# Altium schematic sheet Motor.SchDoc
size A4; SheetNumber: 5; SheetTotal: 5
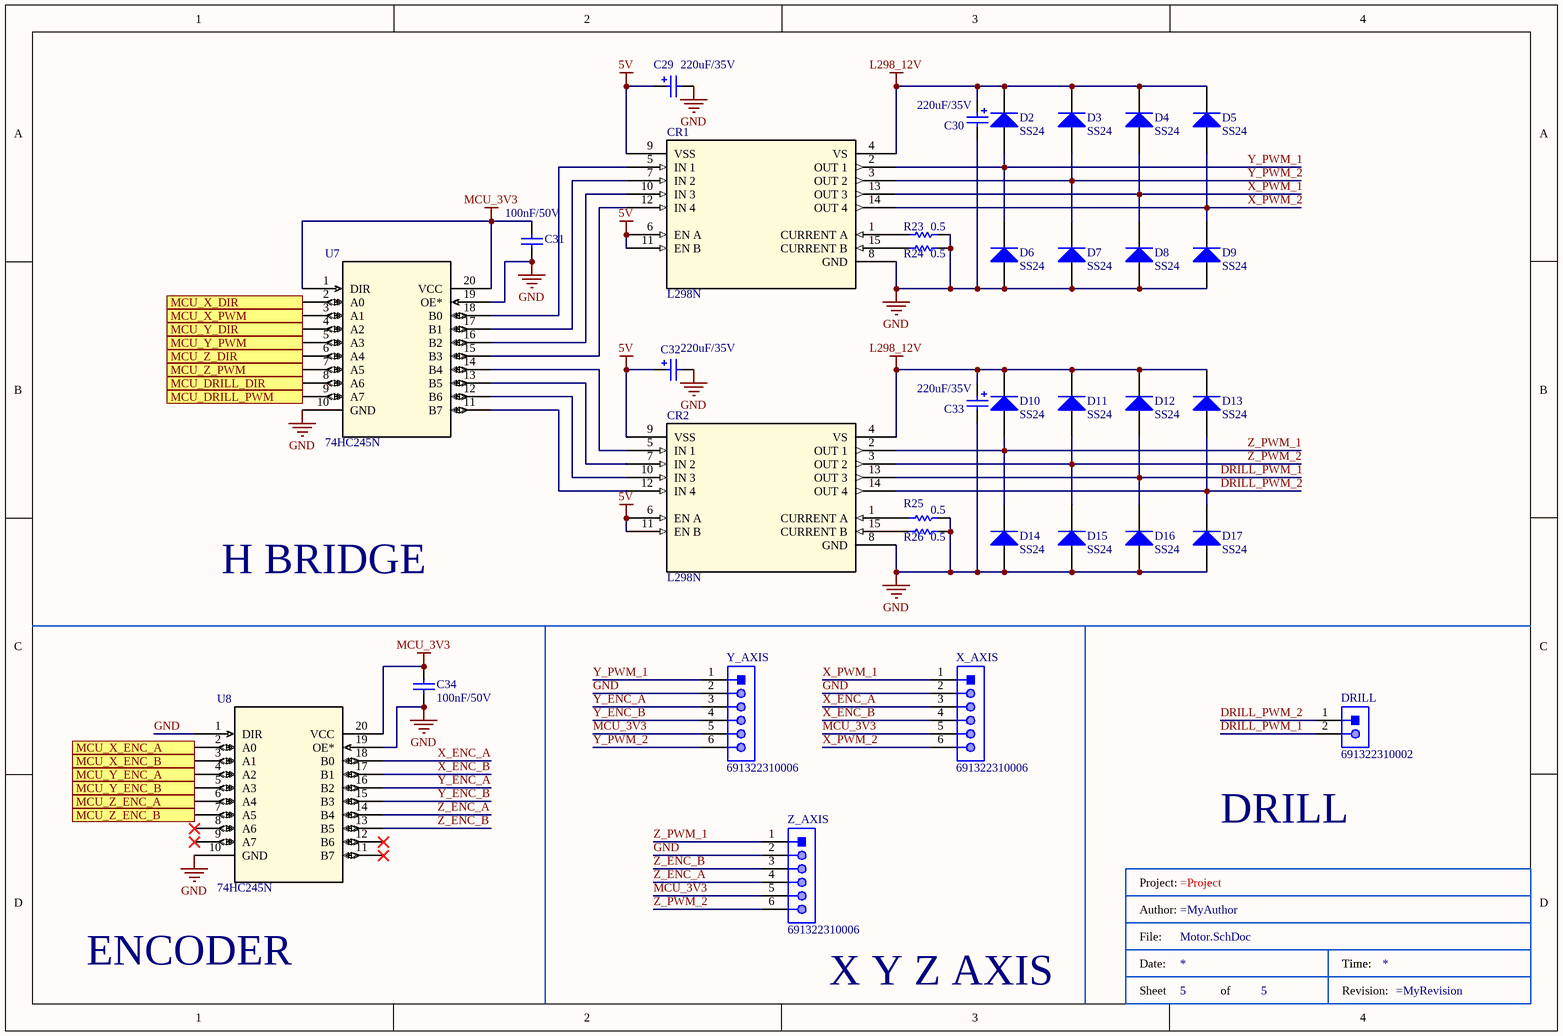
[diagram p0: Motor.SchDoc]

## Parts
*  Title Block  (value not drawn)  (graphical)
C29  value 220uF/35V  [CAP-SM-AL-SIZE-F-D8L10]  (hidden comment: Cap-Al-220uF-35V-D8L10)
C30  value 220uF/35V  [CAP-SM-AL-SIZE-F-D8L10]  (hidden comment: Cap-Al-220uF-35V-D8L10)
C31  value 100nF/50V  [CAP-SM-0805]  (hidden comment: Cap-100nF-50V-0805)
C32  value 220uF/35V  [CAP-SM-AL-SIZE-F-D8L10]  (hidden comment: Cap-Al-220uF-35V-D8L10)
C33  value 220uF/35V  [CAP-SM-AL-SIZE-F-D8L10]  (hidden comment: Cap-Al-220uF-35V-D8L10)
C34  value 100nF/50V  [CAP-SM-0805]  (hidden comment: Cap-100nF-50V-0805)
CR1  L298N  [Multiwatt15_V_STM]
CR2  L298N  [Multiwatt15_V_STM]
D2  SS24  [SS24]
D3  SS24  [SS24]
D4  SS24  [SS24]
D5  SS24  [SS24]
D6  SS24  [SS24]
D7  SS24  [SS24]
D8  SS24  [SS24]
D9  SS24  [SS24]
D10  SS24  [SS24]
D11  SS24  [SS24]
D12  SS24  [SS24]
D13  SS24  [SS24]
D14  SS24  [SS24]
D15  SS24  [SS24]
D16  SS24  [SS24]
D17  SS24  [SS24]
DRILL  691322310002  [691322310002]
R23  value 0.5  [RES-SM-0805]  (hidden comment: Res-0-0805)
R24  value 0.5  [RES-SM-0805]  (hidden comment: Res-0-0805)
R25  value 0.5  [RES-SM-0805]  (hidden comment: Res-0-0805)
R26  value 0.5  [RES-SM-0805]  (hidden comment: Res-0-0805)
U7  74HC245N  [74HC245N]
U8  74HC245N  [74HC245N]
X_AXIS  691322310006  [691322310006]
Y_AXIS  691322310006  [691322310006]
Z_AXIS  691322310006  [691322310006]

## Ports
MCU_DRILL_DIR (in), MCU_DRILL_PWM (in), MCU_X_DIR (in), MCU_X_ENC_A (out), MCU_X_ENC_B (out), MCU_X_PWM (in), MCU_Y_DIR (in), MCU_Y_ENC_A (out), MCU_Y_ENC_B (out), MCU_Y_PWM (in), MCU_Z_DIR (in), MCU_Z_ENC_A (out), MCU_Z_ENC_B (out), MCU_Z_PWM (in)

## Nets
5V: C29.1 C32.1 CR1.6(EN_A) CR1.9(VSS) CR1.11(EN_B) CR2.6(EN_A) CR2.9(VSS) CR2.11(EN_B)
GND: C29.2 C30.2 C31.1 C32.2 C33.2 C34.1 CR1.8(GND) CR2.8(GND) D6.2(A) D7.2(A) D8.2(A) D9.2(A) D14.2(A) D15.2(A) D16.2(A) D17.2(A) R23.1 R24.1 R25.1 R26.1 U7.10(GND) U7.19(OE*) U8.1(DIR) U8.10(GND) U8.19(OE*) X_AXIS.2 Y_AXIS.2 Z_AXIS.2
L298_12V: C30.1 C33.1 CR1.4(VS) CR2.4(VS) D2.1(K) D3.1(K) D4.1(K) D5.1(K) D10.1(K) D11.1(K) D12.1(K) D13.1(K)
MCU_3V3: C31.2 C34.2 U7.1(DIR) U7.20(VCC) U8.20(VCC) X_AXIS.5 Y_AXIS.5 Z_AXIS.5
DRILL_PWM_1: CR2.13(OUT_3) D12.2(A) D16.1(K) DRILL.2
DRILL_PWM_2: CR2.14(OUT_4) D13.2(A) D17.1(K) DRILL.1
MCU_DRILL_DIR: U7.8(A6) ; port MCU_DRILL_DIR
MCU_DRILL_PWM: U7.9(A7) ; port MCU_DRILL_PWM
MCU_X_DIR: U7.2(A0) ; port MCU_X_DIR
MCU_X_ENC_A: U8.2(A0) ; port MCU_X_ENC_A
MCU_X_ENC_B: U8.3(A1) ; port MCU_X_ENC_B
MCU_X_PWM: U7.3(A1) ; port MCU_X_PWM
MCU_Y_DIR: U7.4(A2) ; port MCU_Y_DIR
MCU_Y_ENC_A: U8.4(A2) ; port MCU_Y_ENC_A
MCU_Y_ENC_B: U8.5(A3) ; port MCU_Y_ENC_B
MCU_Y_PWM: U7.5(A3) ; port MCU_Y_PWM
MCU_Z_DIR: U7.6(A4) ; port MCU_Z_DIR
MCU_Z_ENC_A: U8.6(A4) ; port MCU_Z_ENC_A
MCU_Z_ENC_B: U8.7(A5) ; port MCU_Z_ENC_B
MCU_Z_PWM: U7.7(A5) ; port MCU_Z_PWM
X_ENC_A: U8.18(B0) X_AXIS.3
X_ENC_B: U8.17(B1) X_AXIS.4
X_PWM_1: CR1.13(OUT_3) D4.2(A) D8.1(K) X_AXIS.1
X_PWM_2: CR1.14(OUT_4) D5.2(A) D9.1(K) X_AXIS.6
Y_ENC_A: U8.16(B2) Y_AXIS.3
Y_ENC_B: U8.15(B3) Y_AXIS.4
Y_PWM_1: CR1.2(OUT_1) D2.2(A) D6.1(K) Y_AXIS.1
Y_PWM_2: CR1.3(OUT_2) D3.2(A) D7.1(K) Y_AXIS.6
Z_ENC_A: U8.14(B4) Z_AXIS.4
Z_ENC_B: U8.13(B5) Z_AXIS.3
Z_PWM_1: CR2.2(OUT_1) D10.2(A) D14.1(K) Z_AXIS.1
Z_PWM_2: CR2.3(OUT_2) D11.2(A) D15.1(K) Z_AXIS.6
NetCR1_1: CR1.1(CURRENT_A) R23.2
NetCR1_5: CR1.5(IN_1) U7.18(B0)
NetCR1_7: CR1.7(IN_2) U7.17(B1)
NetCR1_10: CR1.10(IN_3) U7.16(B2)
NetCR1_12: CR1.12(IN_4) U7.15(B3)
NetCR1_15: CR1.15(CURRENT_B) R24.2
NetCR2_1: CR2.1(CURRENT_A) R25.2
NetCR2_5: CR2.5(IN_1) U7.14(B4)
NetCR2_7: CR2.7(IN_2) U7.13(B5)
NetCR2_10: CR2.10(IN_3) U7.12(B6)
NetCR2_12: CR2.12(IN_4) U7.11(B7)
NetCR2_15: CR2.15(CURRENT_B) R26.2

Not connected (* = marked no-connect by the designer): U8 8(A6)* 9(A7)* 11(B7)* 12(B6)*

## Notes on the sheet
- H BRIDGE
- (near DRILL) DRILL
- ENCODER
- X Y Z AXIS
- (in symbol Title Block) Project:; Author:; File:; Date:; Time:; Sheet; of; Revision:

## Library data of the parts
C29 C30 C32 C33 = Cap-Al-220uF-35V-D8L10: CAP ALUM 220UF 20% 35V SMD; Manufacturer: Nichicon; Manufacturer Part Number: UWT1V221MNL1GS; Local Supplier: thegioiic; Local Supplier Link: https://thegioiic.com/products/tu-nhom-smd-220uf-35v-d8l10; Supplier 1: Digikey; Supplier 1 Link: https://www.digikey.com/product-detail/en/nichicon/UWT1V221MNL1GS/493-2205-2-ND/589946; Supplier 1 Part Number: 493-2205-2-ND
C31 C34 = Cap-100nF-50V-0805: CAP CER 0.1UF 50V Y5V 0805; Manufacturer: Samsung Electro-Mechanics; Manufacturer Part Number: CL21F104ZBCNNNC; Local Supplier: thegioiic; Local Supplier Link: https://www.thegioiic.com/products/tu-gom-0805-100nf-0-1uf-50v; Supplier 1: Digikey; Supplier 1 Part Number: 1276-1007-1-ND; Supplier 1 Link: https://www.digikey.com/product-detail/en/samsung-electro-mechanics/CL21F104ZBCNNNC/1276-1007-1-ND/3889093
CR1 CR2 = L298N: No Description Available; Mfr_Name: STMicroelectronics; Type: DEV; Copyright: Copyright (C) 2023 Ultra Librarian. All rights reserved.; Manufacturer_Part_Number: L298N; RefDes: RefDes
D2-D17 = Diode-SS24: DIODE SCHOTTKY 40V 2A DO214AA; Manufacturer: ON Semiconductor; Local Supplier: thegioiic; Local Supplier Link: https://thegioiic.com/products/ss24-smb; Supplier 1: Digikey; Supplier 1 Part Number: SS24FSCT-ND; Manufacturer Part Number: SS24; Supplier 1 Link: https://www.digikey.com/product-detail/en/on-semiconductor/SS24/SS24FSCT-ND/1626273
DRILL = 691322310002: WR-TBL Serie 322 Horizontal PCB Header, Pluggable, pitch 3.81mm, 2p; Compliance: RoHS; Modularity: No; Pin Number: 2; Rated Current [UL]: 10A; Working Voltage [UL]: 300VAC; ComponentLink1Description: Manufacturer; ComponentLink1URL: http://www.we-online.de; ComponentLink2URL: https://katalog.we-online.de/em/datasheet/691322310002.pdf; ComponentLink2Description: Datasheet; Mounting Technology: THT; Part Number: 691322310002; Packaging: Box; Operating Temperature: -40 to +105degC; PCB/Cable/Panel: PCB; Pitch: 3.81mm; Published Date: October 2019; Type: Horizontal; Publisher: Wurth Elektronik; Application: Pluggable
R23-R26 = Res-0-0805: RES 0 OHM JUMPER 0805; Manufacturer: Vishay Dale; Manufacturer Part Number: WSL080500000ZEA9; Local Supplier: thegioiic; Local Supplier Link: https://thegioiic.com/products/dien-tro-0-ohm-0805-5; Supplier 1: Digikey; Supplier 1 Link: https://www.digikey.com/product-detail/en/vishay-dale/WSL080500000ZEA9/541-3928-1-ND/7423223; Supplier 1 Part Number: 541-3928-1-ND
U7 U8 = 74HC245N: No Description Available; Mfr_Name: NXP; Copyright: Copyright (C) 2022 Ultra Librarian. All rights reserved.; Manufacturer_Part_Number: 74HC245N; RefDes: RefDes; Type: DEV
X_AXIS Y_AXIS Z_AXIS = 691322310006: WR-TBL Serie 322 Horizontal PCB Header, Pluggable, pitch 3.81mm, 6p; Compliance: RoHS; Modularity: No; Pin Number: 6; Rated Current [UL]: 10A; Working Voltage [UL]: 300VAC; ComponentLink1Description: Manufacturer; ComponentLink1URL: http://www.we-online.de; ComponentLink2URL: https://katalog.we-online.de/em/datasheet/691322310006.pdf; ComponentLink2Description: Datasheet; Mounting Technology: THT; Part Number: 691322310006; Packaging: Box; Operating Temperature: -40 to +105degC; PCB/Cable/Panel: PCB; Pitch: 3.81mm; Published Date: October 2019; Type: Horizontal; Publisher: Wurth Elektronik; Application: Pluggable